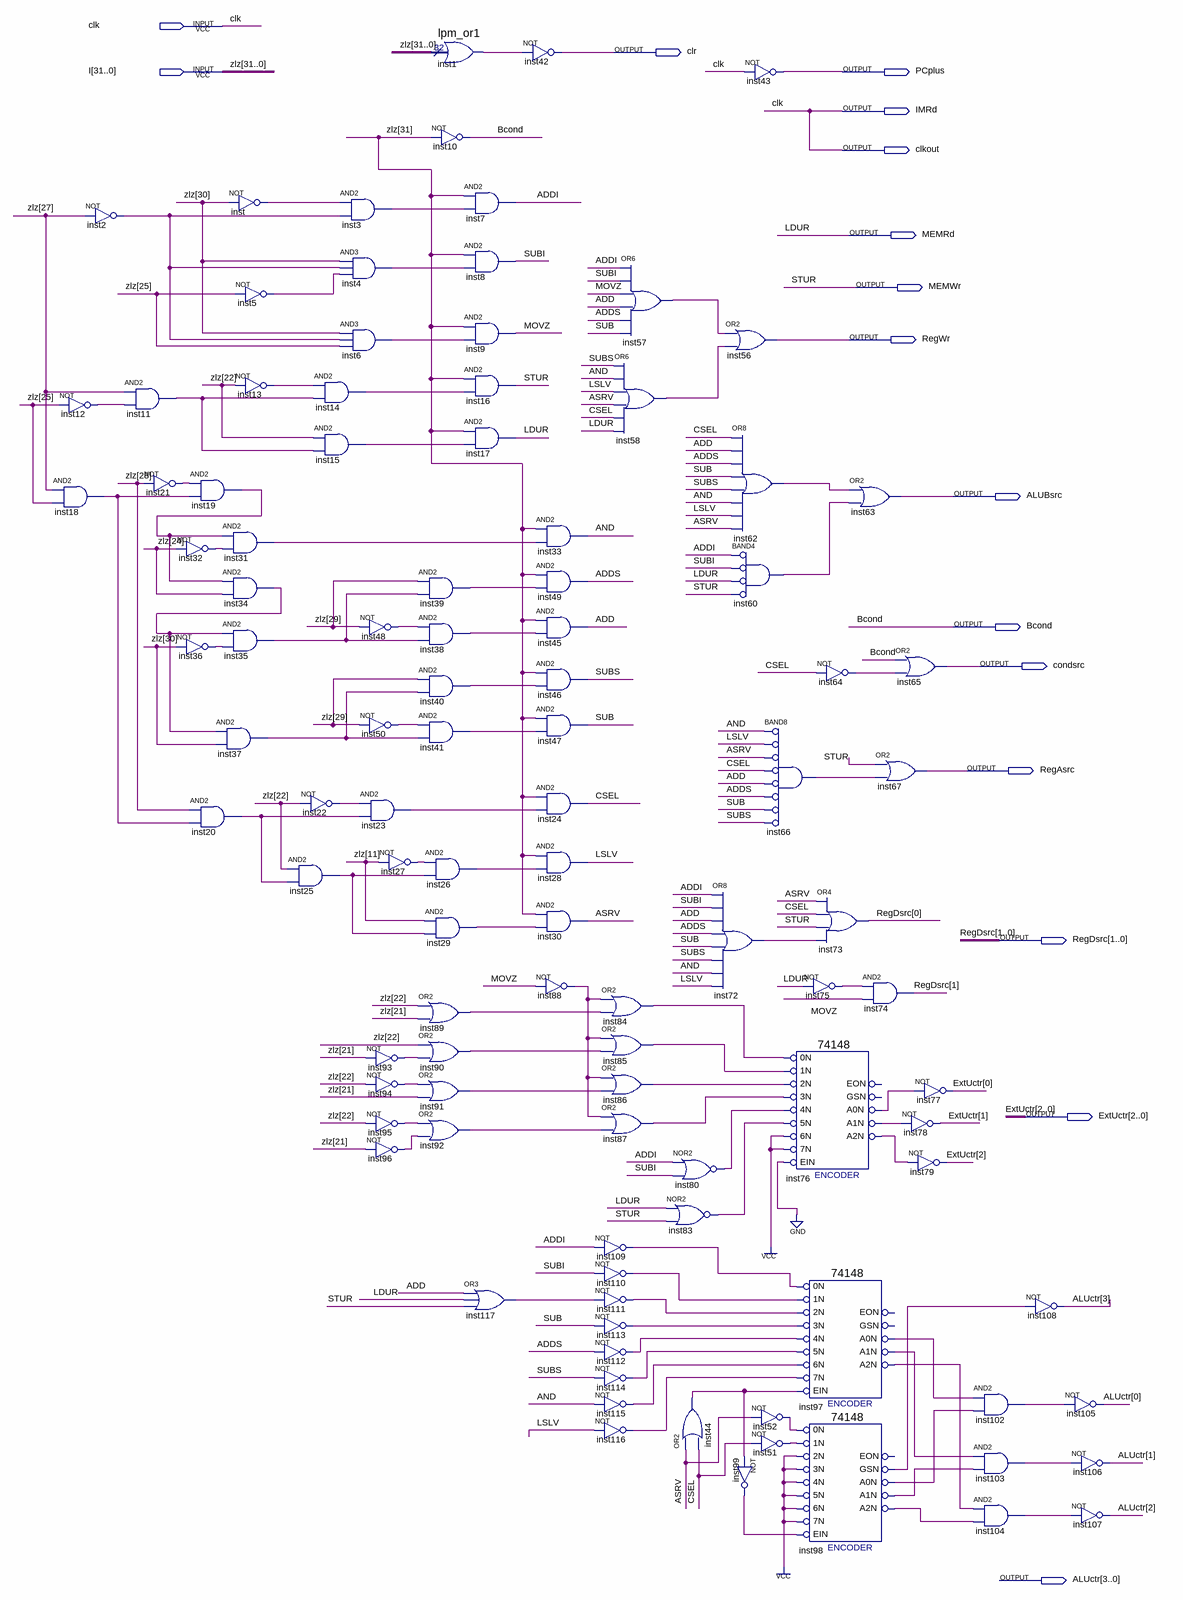
[diagram p0: schematic sheet]
// Quartus schematic CU.bdf as structural Verilog: 105 symbols, 16 pins
module CU (
  input  clk,
  input  [31:0] I,
  output clr,
  output PCplus,
  output IMRd,
  output clkout,
  output MEMRd,
  output MEMWr,
  output RegWr,
  output ALUBsrc,
  output Bcond,
  output condsrc,
  output RegAsrc,
  output [1:0] RegDsrc,
  output [2:0] ExtUctr,
  output [3:0] ALUctr
);

  wire ADD, ADDI, ADDS, AND, ASRV, CSEL, inst1_result, inst2_out, inst3_out, inst4_out, inst5_out, inst6_out,
       inst11_out, inst12_out, inst13_out, inst14_out, inst15_out, inst18_out, inst19_out, inst20_out,
       inst21_out, inst22_out, inst23_out, inst25_out, inst26_out, inst27_out, inst29_out, inst31_out,
       inst32_out, inst34_out, inst35_out, inst36_out, inst37_out, inst38_out, inst39_out, inst40_out,
       inst41_out, inst44_out, inst48_out, inst50_out, inst51_out, inst52_out, inst57_out, inst58_out,
       inst60_out, inst62_out, inst64_out, inst66_out, inst72_out, inst75_out, inst76_a0n, inst76_a1n,
       inst76_a2n, inst80_out, inst83_out, inst84_out, inst85_out, inst86_out, inst87_out, inst88_out,
       inst89_out, inst90_out, inst91_out, inst92_out, inst93_out, inst94_out, inst95_out, inst96_out,
       inst97_a0n, inst97_a1n, inst97_a2n, inst98_a0n, inst98_a1n, inst98_a2n, inst98_gsn, inst99_out,
       inst102_out, inst103_out, inst104_out, inst109_out, inst110_out, inst111_out, inst112_out,
       inst113_out, inst114_out, inst115_out, inst116_out, inst117_out, inst_out, LSLV, MOVZ, SUB, SUBI, SUBS;

  not inst2 (inst2_out, I[27]);
  not inst12 (inst12_out, I[25]);
  and inst18 (inst18_out, I[27], I[25]);
  and inst11 (inst11_out, I[27], inst12_out);
  not inst21 (inst21_out, I[28]);
  and inst19 (inst19_out, inst21_out, inst18_out);
  not inst32 (inst32_out, I[24]);
  not inst36 (inst36_out, I[30]);
  and inst20 (inst20_out, I[28], inst18_out);
  not inst (inst_out, I[30]);
  not inst5 (inst5_out, I[25]);
  not inst13 (inst13_out, I[22]);
  and inst31 (inst31_out, inst19_out, inst32_out);
  and inst34 (inst34_out, inst19_out, I[24]);
  and inst35 (inst35_out, inst34_out, inst36_out);
  and inst37 (inst37_out, inst34_out, I[30]);
  not inst22 (inst22_out, I[22]);
  and inst25 (inst25_out, I[22], inst20_out);
  and inst3 (inst3_out, inst_out, inst2_out);
  and inst4 (inst4_out, I[30], inst2_out, inst5_out);
  and inst6 (inst6_out, I[30], inst2_out, I[25]);
  and inst14 (inst14_out, inst13_out, inst11_out);
  and inst15 (inst15_out, I[22], inst11_out);
  not inst48 (inst48_out, I[29]);
  not inst50 (inst50_out, I[29]);
  and inst23 (inst23_out, inst22_out, inst20_out);
  not inst27 (inst27_out, I[11]);
  not inst93 (inst93_out, I[21]);
  not inst94 (inst94_out, I[22]);
  not inst95 (inst95_out, I[22]);
  not inst96 (inst96_out, I[21]);
  lpm_or1 inst1 (.data(I), .result(inst1_result));
  not inst10 (Bcond, I[31]);
  and inst7 (ADDI, I[31], inst3_out);
  and inst8 (SUBI, I[31], inst4_out);
  and inst9 (MOVZ, I[31], inst6_out);
  and inst16 (MEMWr, I[31], inst14_out);
  and inst17 (MEMRd, I[31], inst15_out);
  and inst39 (inst39_out, I[29], inst35_out);
  and inst38 (inst38_out, inst48_out, inst35_out);
  and inst40 (inst40_out, I[29], inst37_out);
  and inst41 (inst41_out, inst50_out, inst37_out);
  and inst26 (inst26_out, inst27_out, inst25_out);
  and inst29 (inst29_out, I[11], inst25_out);
  or inst89 (inst89_out, I[22], I[21]);
  or inst90 (inst90_out, I[22], inst93_out);
  or inst91 (inst91_out, inst94_out, I[21]);
  or inst92 (inst92_out, inst95_out, inst96_out);
  or inst117 (inst117_out, ADD, MEMRd, MEMWr);
  not inst42 (clr, inst1_result);
  and inst33 (AND, I[31], inst31_out);
  and inst49 (ADDS, I[31], inst39_out);
  and inst45 (ADD, I[31], inst38_out);
  and inst46 (SUBS, I[31], inst40_out);
  and inst47 (SUB, I[31], inst41_out);
  and inst24 (CSEL, I[31], inst23_out);
  and inst28 (LSLV, I[31], inst26_out);
  and inst30 (ASRV, I[31], inst29_out);
  not inst88 (inst88_out, MOVZ);
  or inst57 (inst57_out, ADDI, SUBI, MOVZ, ADD, ADDS, SUB);
  or inst58 (inst58_out, SUBS, AND, LSLV, ASRV, CSEL, MEMRd);
  or inst84 (inst84_out, inst88_out, inst89_out);
  or inst85 (inst85_out, inst88_out, inst90_out);
  or inst86 (inst86_out, inst88_out, inst91_out);
  or inst87 (inst87_out, inst88_out, inst92_out);
  not inst109 (inst109_out, ADDI);
  not inst110 (inst110_out, SUBI);
  not inst111 (inst111_out, inst117_out);
  not inst113 (inst113_out, SUB);
  not inst112 (inst112_out, ADDS);
  not inst114 (inst114_out, SUBS);
  not inst115 (inst115_out, AND);
  not inst116 (inst116_out, LSLV);
  nor inst80 (inst80_out, ADDI, SUBI);
  nor inst83 (inst83_out, MEMRd, MEMWr);
  or inst44 (inst44_out, ASRV, CSEL);
  or inst56 (RegWr, inst57_out, inst58_out);
  or inst72 (inst72_out, ADDI, SUBI, ADD, ADDS, SUB, SUBS, AND, LSLV);
  not inst43 (PCplus, clk);
  or inst62 (inst62_out, CSEL, ADD, ADDS, SUB, SUBS, AND, LSLV, ASRV);
  and inst60 (inst60_out, ~ADDI, ~SUBI, ~MEMRd, ~MEMWr);  // BAND4
  and inst66 (inst66_out, ~AND, ~LSLV, ~ASRV, ~CSEL, ~ADD, ~ADDS, ~SUB, ~SUBS);  // BAND8
  not inst52 (inst52_out, ASRV);
  not inst51 (inst51_out, CSEL);
  not inst99 (inst99_out, inst44_out);
  not inst64 (inst64_out, CSEL);
  or inst73 (RegDsrc[0], ASRV, CSEL, MEMWr, inst72_out);
  not inst75 (inst75_out, MEMRd);
  \74148  inst76 (
    .\5N (inst83_out), .\0N (inst84_out), .\1N (inst85_out), .\2N (inst86_out), .\3N (inst87_out),
    .\4N (inst80_out), .EIN(1'b0), .\6N (1'b1), .\7N (1'b1), .A1N(inst76_a1n), .A0N(inst76_a0n),
    .A2N(inst76_a2n));  // open: EON, GSN
  \74148  inst97 (
    .\5N (inst114_out), .\0N (inst109_out), .\1N (inst110_out), .\2N (inst111_out), .\3N (inst113_out),
    .\4N (inst112_out), .EIN(inst44_out), .\6N (inst115_out), .\7N (inst116_out), .A1N(inst97_a1n),
    .A0N(inst97_a0n), .A2N(inst97_a2n));  // open: EON, GSN
  \74148  inst98 (
    .\5N (1'b1), .\0N (inst52_out), .\1N (inst51_out), .\2N (1'b1), .\3N (1'b1), .\4N (1'b1),
    .EIN(inst99_out), .\6N (1'b1), .\7N (1'b1), .A1N(inst98_a1n), .A0N(inst98_a0n), .A2N(inst98_a2n),
    .GSN(inst98_gsn));  // open: EON
  or inst63 (ALUBsrc, inst62_out, inst60_out);
  or inst67 (RegAsrc, MEMWr, inst66_out);
  and inst74 (RegDsrc[1], inst75_out, MOVZ);
  or inst65 (condsrc, Bcond, inst64_out);
  not inst77 (ExtUctr[0], inst76_a0n);
  not inst78 (ExtUctr[1], inst76_a1n);
  not inst79 (ExtUctr[2], inst76_a2n);
  and inst102 (inst102_out, inst97_a0n, inst98_a0n);
  and inst103 (inst103_out, inst97_a1n, inst98_a1n);
  and inst104 (inst104_out, inst97_a2n, inst98_a2n);
  not inst108 (ALUctr[3], inst98_gsn);
  not inst105 (ALUctr[0], inst102_out);
  not inst106 (ALUctr[1], inst103_out);
  not inst107 (ALUctr[2], inst104_out);

  assign clkout = clk;
  assign IMRd = clk;

  // Other names for the same wires on the sheet: LDUR = MEMRd; STUR = MEMWr; zlz[31:0] = I
endmodule
